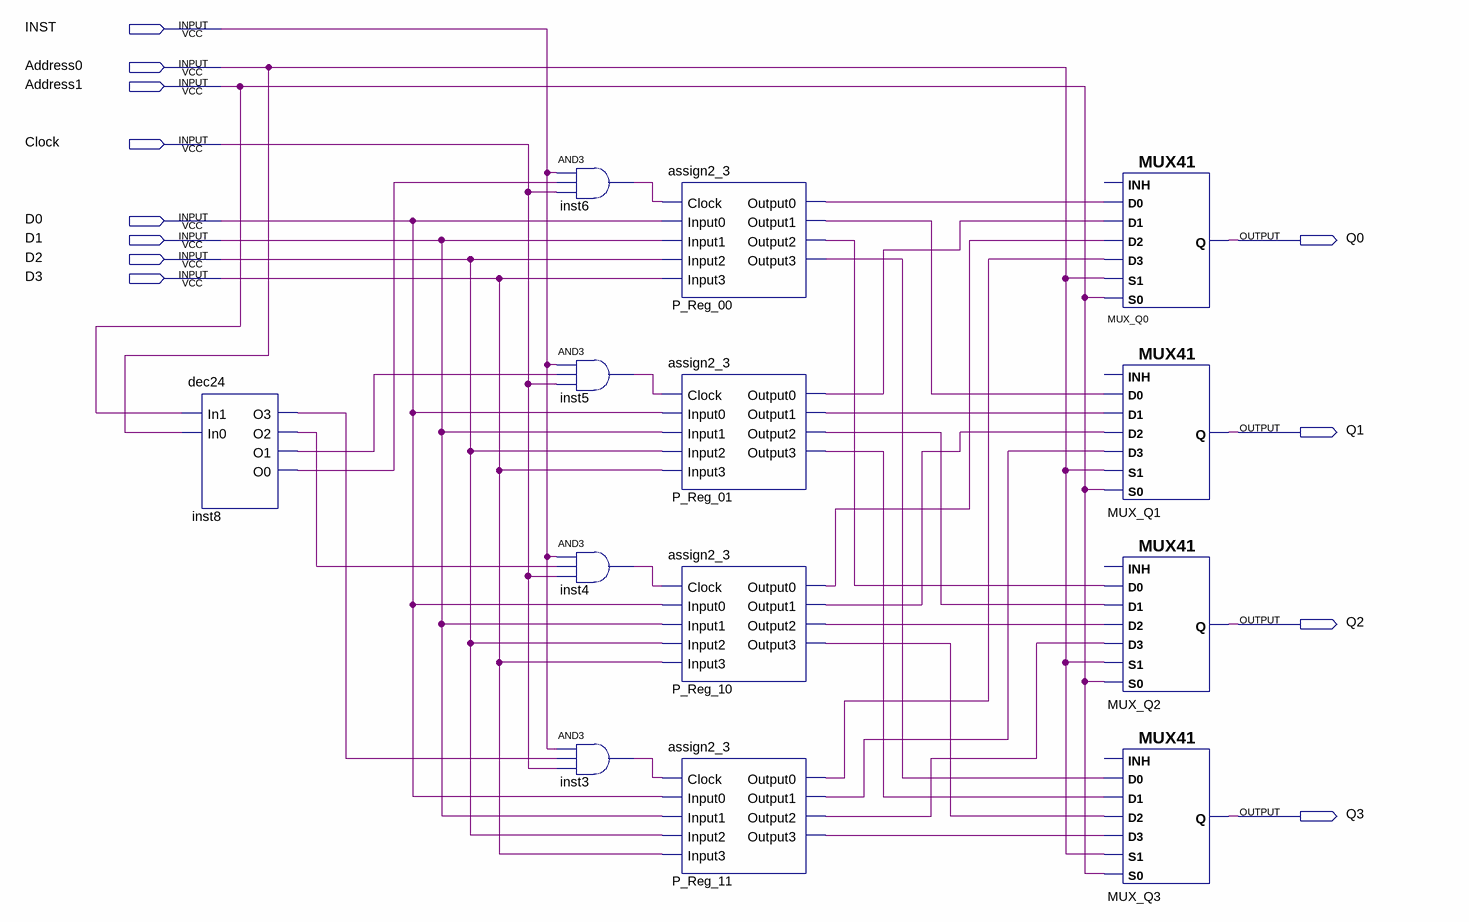
[diagram p0: schematic sheet]
// Quartus schematic readin_reg.bdf as structural Verilog: 13 symbols, 12 pins
module readin_reg (
  input  INST,
  input  Address0,
  input  Address1,
  input  Clock,
  input  D0,
  input  D1,
  input  D2,
  input  D3,
  output Q0,
  output Q1,
  output Q2,
  output Q3
);

  wire inst3_out, inst4_out, inst5_out, inst6_out, inst8_o0, inst8_o1, inst8_o2, inst8_o3, P_Reg_00_output0,
       P_Reg_00_output1, P_Reg_00_output2, P_Reg_00_output3, P_Reg_01_output0, P_Reg_01_output1,
       P_Reg_01_output2, P_Reg_01_output3, P_Reg_10_output0, P_Reg_10_output1, P_Reg_10_output2,
       P_Reg_10_output3, P_Reg_11_output0, P_Reg_11_output1, P_Reg_11_output2, P_Reg_11_output3;

  dec24 inst8 (.In1(Address1), .In0(Address0), .O3(inst8_o3), .O2(inst8_o2), .O1(inst8_o1), .O0(inst8_o0));
  and inst6 (inst6_out, INST, inst8_o0, Clock);
  and inst5 (inst5_out, INST, inst8_o1, Clock);
  and inst4 (inst4_out, INST, inst8_o2, Clock);
  and inst3 (inst3_out, INST, inst8_o3, Clock);
  assign2_3 P_Reg_00 (
    .Clock(inst6_out), .Input0(D0), .Input1(D1), .Input2(D2), .Input3(D3), .Output0(P_Reg_00_output0),
    .Output1(P_Reg_00_output1), .Output2(P_Reg_00_output2), .Output3(P_Reg_00_output3));
  assign2_3 P_Reg_01 (
    .Clock(inst5_out), .Input0(D0), .Input1(D1), .Input2(D2), .Input3(D3), .Output0(P_Reg_01_output0),
    .Output1(P_Reg_01_output1), .Output2(P_Reg_01_output2), .Output3(P_Reg_01_output3));
  assign2_3 P_Reg_10 (
    .Clock(inst4_out), .Input0(D0), .Input1(D1), .Input2(D2), .Input3(D3), .Output0(P_Reg_10_output0),
    .Output1(P_Reg_10_output1), .Output2(P_Reg_10_output2), .Output3(P_Reg_10_output3));
  assign2_3 P_Reg_11 (
    .Clock(inst3_out), .Input0(D0), .Input1(D1), .Input2(D2), .Input3(D3), .Output0(P_Reg_11_output0),
    .Output1(P_Reg_11_output1), .Output2(P_Reg_11_output2), .Output3(P_Reg_11_output3));
  MUX41 MUX_Q0 (
    .S0(Address1), .D2(P_Reg_10_output0), .S1(Address0), .D3(P_Reg_11_output0), .D0(P_Reg_00_output0),
    .D1(P_Reg_01_output0), .Q(Q0));  // open: INH
  MUX41 MUX_Q1 (
    .S0(Address1), .D2(P_Reg_10_output1), .S1(Address0), .D3(P_Reg_11_output1), .D0(P_Reg_00_output1),
    .D1(P_Reg_01_output1), .Q(Q1));  // open: INH
  MUX41 MUX_Q2 (
    .S0(Address1), .D2(P_Reg_10_output2), .S1(Address0), .D3(P_Reg_11_output2), .D0(P_Reg_00_output2),
    .D1(P_Reg_01_output2), .Q(Q2));  // open: INH
  MUX41 MUX_Q3 (
    .S0(Address1), .D2(P_Reg_10_output3), .S1(Address0), .D3(P_Reg_11_output3), .D0(P_Reg_00_output3),
    .D1(P_Reg_01_output3), .Q(Q3));  // open: INH
endmodule
